# EAGLE board Analog CAN Module (EAGLE 7.4.0), part 1 of 2
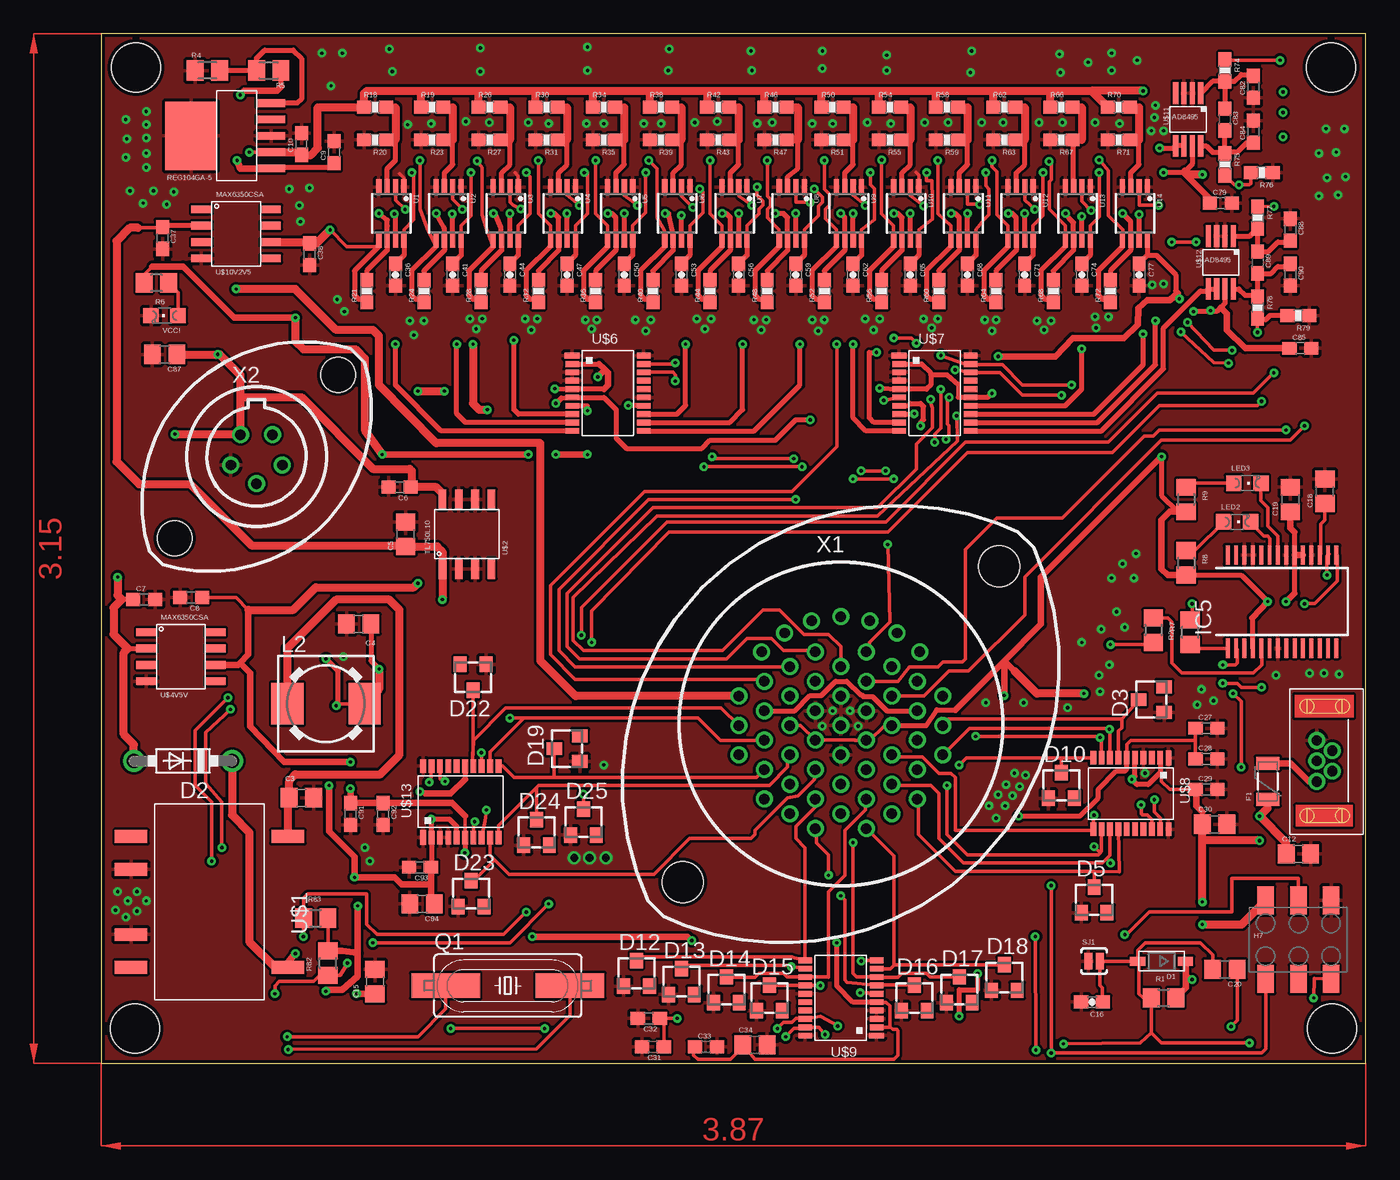
[diagram p2: board, top side]
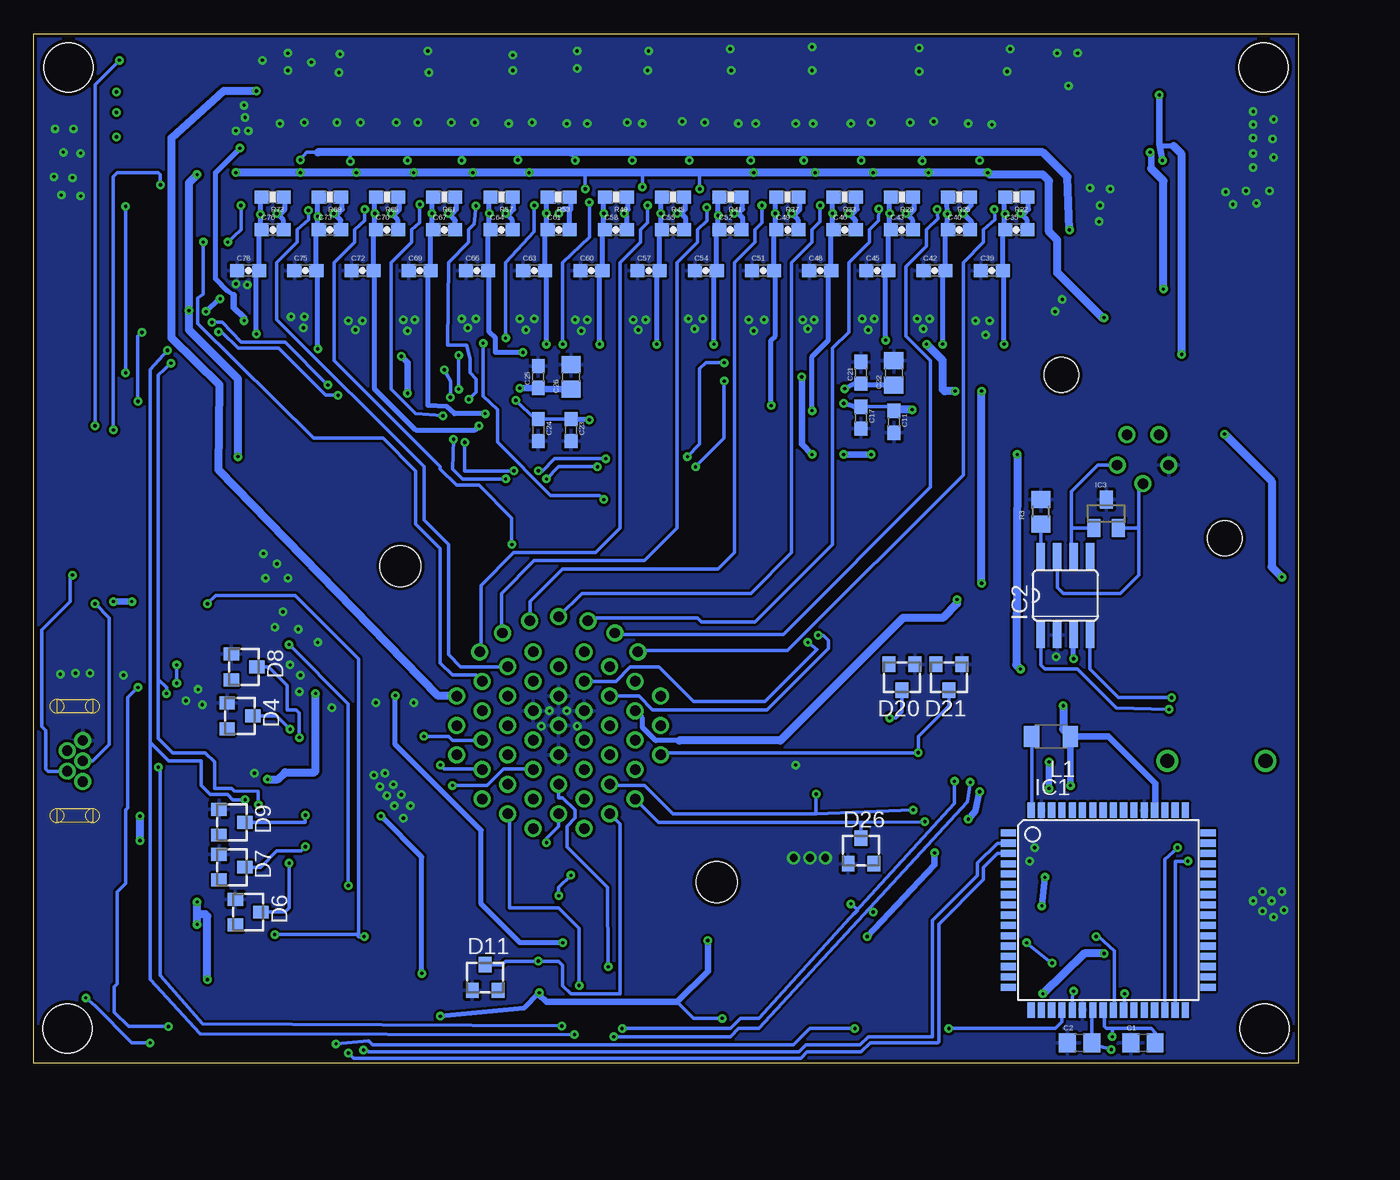
[diagram p3: board, bottom side, seen from below]

Size 98.25 x 80 mm. Coordinates in mm from the lower left corner, seen from the top.
Outline: 0,0 98.25,0 98.25,80 0,80 0,0
Copper layers (1*16): Top 0.035mm / dielectric 1.5mm / Bottom 0.035mm
Design rules "default *": minimum track width 8mil, minimum drill 10mil, track to track 8mil, track to pad 8mil, pad to pad 8mil, via to via 8mil, smd to smd 8mil, copper to edge 11mil, drill to drill 11mil, minimum pad ring 10mil, minimum via ring 8mil, stop-mask expansion 4mil, vias tented up to drill 0mil, thermal gap 10mil
Holes 3.81 mm at 95.57,77.39 2.7,77.39 2.62,2.7 95.65,2.7

## Footprints (pad centres in the part's own frame; a part is rotated, then mirrored left to right if it is on the bottom)
C0805 = smd 1.3 x 1.5: 1 -0.95,0; 2 0.95,0
C0603 = smd 1.1 x 1: 1 -0.85,0; 2 0.85,0
0603-CAP = smd 1.1 x 1: 1 -0.85,0; 2 0.85,0
SOD-123 = smd 1.2 x 0.7: A 1.85,0; C -1.85,0
DO41-7.6 = drill 1.1 pad 1.7: A 3.81,0; C -3.81,0
TO236 = smd 1 x 1.2: A -1,-1; C 0,1; NC 1,-1
PTC-1206 = smd 1 x 1.8: 1 -1.4,0; 2 1.4,0
2X3_SMD_FCI_54202-G30 = smd 1.27 x 2.18: 1 -2.54,-3.05; 2 -2.54,3.05; 3 0,-3.05; 4 0,3.05; 5 2.54,-3.05; 6 2.54,3.05
TQFP64 = smd 1.194 x 0.559: 1 -7.76,6; 2 -7.76,5.2; 3 -7.76,4.4; 4 -7.76,3.6; 5 -7.76,2.8; 6 -7.76,2; 7 -7.76,1.2; 8 -7.76,0.4; 9 -7.76,-0.4; 10 -7.76,-1.2; 11 -7.76,-2; 12 -7.76,-2.8; 13 -7.76,-3.6; 14 -7.76,-4.4; 15 -7.76,-5.2; 16 -7.76,-6; 33 7.76,-6; 34 7.76,-5.2; 35 7.76,-4.4; 36 7.76,-3.6; 37 7.76,-2.8; 38 7.76,-2; 39 7.76,-1.2; 40 7.76,-0.4; 41 7.76,0.4; 42 7.76,1.2; 43 7.76,2; 44 7.76,2.8; 45 7.76,3.6; 46 7.76,4.4; 47 7.76,5.2; 48 7.76,6 | smd 0.559 x 1.194: 17 -6,-7.76; 18 -5.2,-7.76; 19 -4.4,-7.76; 20 -3.6,-7.76; 21 -2.8,-7.76; 22 -2,-7.76; 23 -1.2,-7.76; 24 -0.4,-7.76; 25 0.4,-7.76; 26 1.2,-7.76; 27 2,-7.76; 28 2.8,-7.76; 29 3.6,-7.76; 30 4.4,-7.76; 31 5.2,-7.76; 32 6,-7.76; 49 6,7.76; 50 5.2,7.76; 51 4.4,7.76; 52 3.6,7.76; 53 2.8,7.76; 54 2,7.76; 55 1.2,7.76; 56 0.4,7.76; 57 -0.4,7.76; 58 -1.2,7.76; 59 -2,7.76; 60 -2.8,7.76; 61 -3.6,7.76; 62 -4.4,7.76; 63 -5.2,7.76; 64 -6,7.76
SO08 = smd 0.66 x 2.032: 1 -1.905,-3.073; 2 -0.635,-3.073; 3 0.635,-3.073; 4 1.905,-3.073; 5 1.905,3.073; 6 0.635,3.073; 7 -0.635,3.073; 8 -1.905,3.073
SOT-23 = smd 1 x 1.4: 1 -0.95,-1.1; 2 0.95,-1.1; 3 0,1.1
SSOP28 = smd 0.381 x 1.499: 1 -4.225,-3.625; 2 -3.575,-3.625; 3 -2.925,-3.625; 4 -2.275,-3.625; 5 -1.625,-3.625; 6 -0.975,-3.625; 7 -0.325,-3.625; 8 0.325,-3.625; 9 0.975,-3.625; 10 1.625,-3.625; 11 2.275,-3.625; 12 2.925,-3.625; 13 3.575,-3.625; 14 4.225,-3.625; 15 4.225,3.625; 16 3.575,3.625; 17 2.925,3.625; 18 2.275,3.625; 19 1.625,3.625; 20 0.975,3.625; 21 0.325,3.625; 22 -0.325,3.625; 23 -0.975,3.625; 24 -1.625,3.625; 25 -2.275,3.625; 26 -2.925,3.625; 27 -3.575,3.625; 28 -4.225,3.625
L3216C = smd 1.2 x 1.6: 1 -1.5,0; 2 1.5,0
DR73 = smd 2.5 x 3.25: 1 -3,0; 2 3,0
CHIPLED_0805 = smd 1.2 x 1.2: A 0,-1.05; C 0,1.05
HC49UP = smd 5.334 x 1.93: 1 -4.826,0; 2 4.826,0
R0805 = smd 1.3 x 1.5: 1 -0.95,0; 2 0.95,0
M0805 = smd 1.3 x 1.6: 1 -0.95,0; 2 0.95,0
0603-RES = smd 1.1 x 1: 1 -0.85,0; 2 0.85,0
SJ_2S-NO = smd 0.635 x 1.27: 1 -0.45,0; 2 0.45,0
MSOP8 = smd 0.4 x 1.2: 1 -0.975,-2.05; 2 -0.325,-2.05; 3 0.325,-2.05; 4 0.975,-2.05; 5 0.975,2.05; 6 0.325,2.05; 7 -0.325,2.05; 8 -0.975,2.05
V78XX-1000 = smd 1 x 2.54: 1 -5.08,-6.096; 5 5.08,-6.096; 6 5.08,6.096; 7 2.54,6.096; 9 -2.54,6.096; 10 -5.08,6.096
8-SOIC = smd 0.6 x 1.55: P1 -1.905,-2.7; P2 -0.635,-2.7; P3 0.635,-2.7; P4 1.905,-2.7; P5 1.905,2.7; P6 0.635,2.7; P7 -0.635,2.7; P8 -1.905,2.7
REG104GA-5 = smd 0.6 x 2.2: ENABLE 2.54,-6.2; GND 0,-6.2; NR/ADJUST 1.27,-6.2; VIN -2.54,-6.2; VOUT -1.27,-6.2 | smd 5.3 x 4: HEATGND 0,0
20TSSOP = smd 0.45 x 1.15: 1 -2.925,-2.775 | smd 0.45 x 1.05: 2 -2.275,-2.775; 3 -1.625,-2.775; 4 -0.975,-2.775; 5 -0.325,-2.775; 6 0.325,-2.775; 7 0.975,-2.775; 8 1.625,-2.775; 9 2.275,-2.775; 10 2.925,-2.775; 11 2.925,2.775; 12 2.275,2.775; 13 1.625,2.775; 14 0.975,2.775; 15 0.325,2.775; 16 -0.325,2.775; 17 -0.975,2.775; 18 -1.625,2.775; 19 -2.275,2.775; 20 -2.925,2.775
8MSOP = smd 0.4 x 1.7: P1 -0.975,-2.05; P2 -0.325,-2.05; P3 0.325,-2.05; P4 0.975,-2.05; P5 0.975,2.05; P6 0.325,2.05; P7 -0.325,2.05; P8 -0.975,2.05
MUSBB = drill 0.8: P1 -1.6,0; P2 -0.8,-1.2; P3 0,0; P4 0.8,-1.2; P5 1.6,0
AS16-35 = drill 0.813: 1 -7.925,2.184; 2 -7.925,-0.102; 3 -7.925,-2.388; 4 -6.147,5.613; 5 -5.944,3.327; 6 -5.944,1.041; 7 -5.944,-1.245; 8 -5.944,-3.531; 9 -5.944,-5.817; 10 -4.369,7.087; 11 -3.962,4.47; 12 -3.962,2.184; 13 -3.962,-0.102; 14 -3.962,-2.388; 15 -3.962,-4.674; 16 -3.962,-6.96; 17 -2.261,8.026; 18 -1.981,5.613; 19 -1.981,3.327; 20 -1.981,1.041; 21 -1.981,-1.245; 22 -1.981,-3.531; 23 -1.981,-5.817; 24 -1.981,-8.103; 25 0,8.357; 26 0,4.47; 27 0,2.184; 28 0,-0.102; 29 0,-2.388; 30 0,-4.674; 31 0,-6.96; 32 2.261,8.026; 33 1.981,5.613; 34 1.981,3.327; 35 1.981,1.041; 36 1.981,-1.245; 37 1.981,-3.531; 38 1.981,-5.817; 39 1.981,-8.103; 40 4.369,7.087; 41 3.962,4.47; 42 3.962,2.184; 43 3.962,-0.102; 44 3.962,-2.388; 45 3.962,-4.674; 46 3.962,-6.96; 47 6.147,5.613; 48 5.944,3.327; 49 5.944,1.041; 50 5.944,-1.245; 51 5.944,-3.531; 52 5.944,-5.817; 53 7.925,2.184; 54 7.925,-0.102; 55 7.925,-2.388 | hole 3.2: 12.29,12.29; -12.29,-12.29
AS06-05 = drill 0.813: 1 -1.245,1.702; 2 -2.007,-0.66; 3 0,-2.108; 4 2.007,-0.66; 5 1.245,1.702 | hole 2.7: -6.35,-6.35; 6.35,6.35

## Placement (x,y rotation side)
C1  18pF  [C0805]  12.06,1.59 0 bottom
C2  18pF  [C0805]  16.99,1.59 0 bottom
C3  22uF  [C0805]  15.56,20.64 0 top
C4  22uF  [C0805]  20,34.13 180 top
C5  10uF  [C0805]  23.65,41.12 90 top
C6  0.1uF  [C0603]  23.18,44.77 180 top
C7  2.2uF  [C0603]  3.33,36.04 0 top
C8  2.2uF  [C0603]  6.99,36.2 180 top
C9  0.1uF  [C0603]  18.1,70.8 90 top
C10  0.1uF  [C0603]  15.56,71.44 90 top
C11  1uF  [C0603]  31.43,49.85 270 bottom
C12  100n  [C0805]  93.03,16.27 0 top
C15  10uF  [C0805]  21.27,6.35 90 top
C16  4.7nF  [0603-CAP]  76.99,4.76 180 top
C17  0.1uF  [C0603]  33.97,50.16 270 bottom
C18  100n  [C0805]  95.09,44.45 90 top
C19  100n  [C0805]  92.39,43.81 90 top
C20  100n  [C0805]  87.31,7.3 180 top
C21  0.1uF  [C0603]  33.97,53.66 90 bottom
C22  10uF  [C0805]  31.43,53.66 90 bottom
C23  1uF  [C0603]  56.52,49.21 270 bottom
C24  0.1uF  [C0603]  59.05,49.21 270 bottom
C25  0.1uF  [C0603]  59.05,53.34 90 bottom
C26  10uF  [C0805]  56.52,53.34 90 bottom
C27  1uF  [C0603]  85.88,26.04 0 top
C28  0.1uF  [C0603]  85.88,23.65 0 top
C29  0.1uF  [C0603]  85.88,21.27 0 top
C30  10uF  [C0805]  86.52,18.57 0 top
C31  1uF  [C0603]  42.86,1.27 180 top
C32  0.1uF  [C0603]  42.55,3.49 180 top
C33  0.1uF  [C0603]  46.99,1.27 0 top
C34  10uF  [C0805]  50.8,1.43 0 top
C35  .1uF  [0603-CAP]  21.91,64.77 0 bottom
C36  .1uF  [0603-CAP]  22.86,61.28 270 top
C37  2.2uF  [C0603]  4.76,64.14 270 top
C38  2.2uF  [C0603]  16.19,62.87 270 top
C39  .1uF  [0603-CAP]  23.81,61.59 0 bottom
C40  .1uF  [0603-CAP]  26.35,64.77 0 bottom
C41  .1uF  [0603-CAP]  27.3,61.28 270 top
C42  .1uF  [0603-CAP]  28.26,61.59 0 bottom
C43  .1uF  [0603-CAP]  30.8,64.77 0 bottom
C44  .1uF  [0603-CAP]  31.75,61.28 270 top
C45  .1uF  [0603-CAP]  32.7,61.59 0 bottom
C46  .1uF  [0603-CAP]  35.24,64.77 0 bottom
C47  .1uF  [0603-CAP]  36.2,61.28 270 top
C48  .1uF  [0603-CAP]  37.15,61.59 0 bottom
C49  .1uF  [0603-CAP]  39.69,64.77 0 bottom
C50  .1uF  [0603-CAP]  40.64,61.28 270 top
C51  .1uF  [0603-CAP]  41.59,61.59 0 bottom
C52  .1uF  [0603-CAP]  44.13,64.77 0 bottom
C53  .1uF  [0603-CAP]  45.09,61.28 270 top
C54  .1uF  [0603-CAP]  46.04,61.59 0 bottom
C55  .1uF  [0603-CAP]  48.58,64.77 0 bottom
C56  .1uF  [0603-CAP]  49.53,61.28 270 top
C57  .1uF  [0603-CAP]  50.48,61.59 0 bottom
C58  .1uF  [0603-CAP]  53.02,64.77 0 bottom
C59  .1uF  [0603-CAP]  53.98,61.28 270 top
C60  .1uF  [0603-CAP]  54.93,61.59 0 bottom
C61  .1uF  [0603-CAP]  57.47,64.77 0 bottom
C62  .1uF  [0603-CAP]  58.42,61.28 270 top
C63  .1uF  [0603-CAP]  59.37,61.59 0 bottom
C64  .1uF  [0603-CAP]  61.91,64.77 0 bottom
C65  .1uF  [0603-CAP]  62.87,61.28 270 top
C66  .1uF  [0603-CAP]  63.82,61.59 0 bottom
C67  .1uF  [0603-CAP]  66.36,64.77 0 bottom
C68  .1uF  [0603-CAP]  67.31,61.28 270 top
C69  .1uF  [0603-CAP]  68.26,61.59 0 bottom
C70  .1uF  [0603-CAP]  70.8,64.77 0 bottom
C71  .1uF  [0603-CAP]  71.75,61.28 270 top
C72  .1uF  [0603-CAP]  72.71,61.59 0 bottom
C73  .1uF  [0603-CAP]  75.25,64.77 0 bottom
C74  .1uF  [0603-CAP]  76.2,61.28 270 top
C75  .1uF  [0603-CAP]  77.15,61.59 0 bottom
C76  .1uF  [0603-CAP]  79.69,64.77 0 bottom
C77  .1uF  [0603-CAP]  80.64,61.28 270 top
C78  .1uF  [0603-CAP]  81.6,61.59 0 bottom
C79  0.1uF  [C0603]  87,66.83 0 top
C82  1nF  [C0603]  89.53,75.88 90 top
C83  10nF  [C0603]  87.31,73.34 270 top
C84  1nF  [C0603]  89.53,72.39 90 top
C85  0.1uF  [C0603]  93.19,55.56 0 top
C87  47uF  [C0805]  4.92,55.09 180 top
C88  1nF  [C0603]  92.39,64.77 270 top
C89  10nF  [C0603]  89.85,62.23 270 top
C90  1nF  [C0603]  92.39,61.28 270 top
C91  1uF  [C0603]  19.37,19.37 270 top
C92  0.1uF  [C0603]  21.91,19.37 270 top
C93  0.1uF  [C0603]  24.77,15.24 180 top
C94  10uF  [C0805]  24.92,12.38 180 top
D1  1N4148  [SOD-123]  82.39,7.94 180 top
D2  1N5819  [DO41-7.6]  6.35,23.5 180 top
D3  BZX84CSMD  [TO236]  81.6,28.26 90 top
D4  BZX84CSMD  [TO236]  82.23,26.99 270 bottom
D5  BZX84CSMD  [TO236]  77.15,12.7 0 top
D6  BZX84CSMD  [TO236]  81.6,11.75 270 bottom
D7  BZX84CSMD  [TO236]  82.87,15.24 270 bottom
D8  BZX84CSMD  [TO236]  81.92,30.8 270 bottom
D9  BZX84CSMD  [TO236]  82.87,18.73 270 bottom
D10  BZX84CSMD  [TO236]  74.61,21.59 0 top
D11  BZX84CSMD  [TO236]  63.18,6.67 0 bottom
D12  BZX84CSMD  [TO236]  41.59,6.99 0 top
D13  BZX84CSMD  [TO236]  45.09,6.35 0 top
D14  BZX84CSMD  [TO236]  48.58,5.71 0 top
D15  BZX84CSMD  [TO236]  51.91,5.08 0 top
D16  BZX84CSMD  [TO236]  63.18,5.08 0 top
D17  BZX84CSMD  [TO236]  66.67,5.71 0 top
D18  BZX84CSMD  [TO236]  70.17,6.67 0 top
D19  BZX84CSMD  [TO236]  36.2,24.45 90 top
D20  BZX84CSMD  [TO236]  30.8,30 180 bottom
D21  BZX84CSMD  [TO236]  27.15,30 180 bottom
D22  BZX84CSMD  [TO236]  28.89,30 180 top
D23  BZX84CSMD  [TO236]  28.73,13.18 0 top
D24  BZX84CSMD  [TO236]  33.81,17.94 0 top
D25  BZX84CSMD  [TO236]  37.47,18.73 0 top
D26  BZX84CSMD  [TO236]  33.97,16.51 0 bottom
F1  16V,0.25A  [PTC-1206]  90.65,21.91 90 top
H7  ICSP  [2X3_SMD_FCI_54202-G30]  93.03,9.6 0 top
IC1  AT90CAN128  [TQFP64]  14.76,11.91 0 bottom
IC2  MCP2551SO8  [SO08]  18.1,36.35 0 bottom
IC3  NUP2105L  [SOT-23]  14.92,42.7 0 bottom
IC5  FT232RL  [SSOP28]  91.76,35.88 0 top
L1  CS321613-100K  [L3216C]  19.21,25.4 180 bottom
L2  22uH  [DR73]  17.46,27.94 0 top
LED2  RX  [CHIPLED_0805]  88.27,42.07 270 top
LED3  TX  [CHIPLED_0805]  89.06,45.09 270 top
Q1  56P2859  [HC49UP]  31.59,6.03 0 top
R1  100K  [R0805]  82.55,5.08 0 top
R2  1k  [R0805]  84.61,33.5 90 top
R3  100K  [R0805]  20,42.86 90 bottom
R4  100K  [M0805]  8.26,77.15 0 top
R5  100K  [M0805]  13.02,77.15 180 top
R6  1K  [R0805]  4.29,60.64 180 top
R7  1k  [R0805]  81.76,33.66 270 top
R8  1k  [R0805]  84.3,38.89 270 top
R9  1k  [R0805]  84.3,43.81 270 top
R18  1k  [0603-RES]  21.27,74.3 0 top
R19  1k  [0603-RES]  25.72,74.3 0 top
R20  1k  [0603-RES]  21.27,71.75 180 top
R21  10  [0603-RES]  20.64,60.01 90 top
R22  100R680R3k3  [0603-RES]  21.91,67.31 180 bottom
R23  1k  [0603-RES]  25.72,71.75 180 top
R24  10  [0603-RES]  25.08,60.01 90 top
R25  100R680R3k3  [0603-RES]  26.35,67.31 180 bottom
R26  1k  [0603-RES]  30.16,74.3 0 top
R27  1k  [0603-RES]  30.16,71.75 180 top
R28  10  [0603-RES]  29.53,60.01 90 top
R29  100R680R3k3  [0603-RES]  30.8,67.31 180 bottom
R30  1k  [0603-RES]  34.61,74.3 0 top
R31  1k  [0603-RES]  34.61,71.75 180 top
R32  10  [0603-RES]  33.97,60.01 90 top
R33  100R680R3k3  [0603-RES]  35.24,67.31 180 bottom
R34  1k  [0603-RES]  39.05,74.3 0 top
R35  1k  [0603-RES]  39.05,71.75 180 top
R36  10  [0603-RES]  38.42,60.01 90 top
R37  100R680R3k3  [0603-RES]  39.69,67.31 180 bottom
R38  1k  [0603-RES]  43.5,74.3 0 top
R39  1k  [0603-RES]  43.5,71.75 180 top
R40  10  [0603-RES]  42.86,60.01 90 top
R41  100R680R3k3  [0603-RES]  44.13,67.31 180 bottom
R42  1k  [0603-RES]  47.94,74.3 0 top
R43  1k  [0603-RES]  47.94,71.75 180 top
R44  10  [0603-RES]  47.31,60.01 90 top
R45  100R680R3k3  [0603-RES]  48.58,67.31 180 bottom
R46  1k  [0603-RES]  52.39,74.3 0 top
R47  1k  [0603-RES]  52.39,71.75 180 top
R48  10  [0603-RES]  51.75,60.01 90 top
R49  100R680R3k3  [0603-RES]  53.02,67.31 180 bottom
R50  1k  [0603-RES]  56.83,74.3 0 top
R51  1k  [0603-RES]  56.83,71.75 180 top
R52  10  [0603-RES]  56.2,60.01 90 top
R53  100R680R3k3  [0603-RES]  57.47,67.31 180 bottom
R54  1k  [0603-RES]  61.28,74.3 0 top
R55  1k  [0603-RES]  61.28,71.75 180 top
R56  10  [0603-RES]  60.64,60.01 90 top
R57  100R680R3k3  [0603-RES]  61.91,67.31 180 bottom
R58  1k  [0603-RES]  65.72,74.3 0 top
R59  1k  [0603-RES]  65.72,71.75 180 top
R60  10  [0603-RES]  65.09,60.01 90 top
R61  100R680R3k3  [0603-RES]  66.36,67.31 180 bottom
R62  1k  [0603-RES]  70.17,74.3 0 top
R63  1k  [0603-RES]  70.17,71.75 180 top
R64  10  [0603-RES]  69.53,60.01 90 top
R65  100R680R3k3  [0603-RES]  70.8,67.31 180 bottom
R66  1k  [0603-RES]  74.61,74.3 0 top
R67  1k  [0603-RES]  74.61,71.75 180 top
R68  10  [0603-RES]  73.98,60.01 90 top
R69  100R680R3k3  [0603-RES]  75.25,67.31 180 bottom
R70  1k  [0603-RES]  79.06,74.3 0 top
R71  1k  [0603-RES]  79.06,71.75 180 top
R72  10  [0603-RES]  78.42,60.01 90 top
R73  100R680R3k3  [0603-RES]  79.69,67.31 180 bottom
R74  10K  [0603-RES]  87.31,77.15 270 top
R75  10K  [0603-RES]  87.31,69.85 270 top
R76  1M  [0603-RES]  90.17,69.22 180 top
R77  10K  [0603-RES]  89.85,65.72 270 top
R78  10K  [0603-RES]  89.85,58.74 270 top
R79  1M  [0603-RES]  93.03,58.1 180 top
R82  4.7k  [R0805]  17.62,7.78 90 top
R83  4.7k  [R0805]  16.67,11.27 0 top
SJ1  SOLDERJUMPERNO  [SJ_2S-NO]  77.15,7.94 0 top
U1  LTC2053  [MSOP8]  22.54,66.04 180 top
U2  LTC2053  [MSOP8]  26.99,66.04 180 top
U3  LTC2053  [MSOP8]  31.43,66.04 180 top
U4  LTC2053  [MSOP8]  35.88,66.04 180 top
U5  LTC2053  [MSOP8]  40.32,66.04 180 top
U6  LTC2053  [MSOP8]  44.77,66.04 180 top
U7  LTC2053  [MSOP8]  49.21,66.04 180 top
U8  LTC2053  [MSOP8]  53.66,66.04 180 top
U9  LTC2053  [MSOP8]  58.1,66.04 180 top
U10  LTC2053  [MSOP8]  62.55,66.04 180 top
U11  LTC2053  [MSOP8]  66.99,66.04 180 top
U12  LTC2053  [MSOP8]  71.44,66.04 180 top
U13  LTC2053  [MSOP8]  75.88,66.04 180 top
U14  LTC2053  [MSOP8]  80.33,66.04 180 top
U$1  V7805-1000  [V78XX-1000]  8.41,12.54 90 top
U$2  TL750L10  [8-SOIC]  28.42,41.12 0 top
U$4V5V  MAX6350CSA  [8-SOIC]  6.19,31.59 270 top
U$5  REG-104GA-5  [REG104GA-5]  6.99,72.07 90 top
U$6  AD7998  [20TSSOP]  39.37,52.07 270 top
U$7  AD7998  [20TSSOP]  64.77,52.07 270 top
U$8  AD7998  [20TSSOP]  80.01,20.95 180 top
U$9  AD7998  [20TSSOP]  57.47,5.08 90 top
U$10V2V5  MAX6350CSA  [8-SOIC]  10.48,64.45 270 top
U$11  AD8495  [8MSOP]  84.45,73.34 180 top
U$12  AD8495  [8MSOP]  87,62.23 180 top
U$13  AD7998  [20TSSOP]  27.94,20.32 0 top
U$14  MUSBB  [MUSBB]  94.46,23.5 90 top
VCC!  PWR  [CHIPLED_0805]  4.92,58.1 90 top
X1  AS16-35  [AS16-35]  57.47,26.35 0 top
X2  AS06-05  [AS06-05]  12.06,47.15 0 top